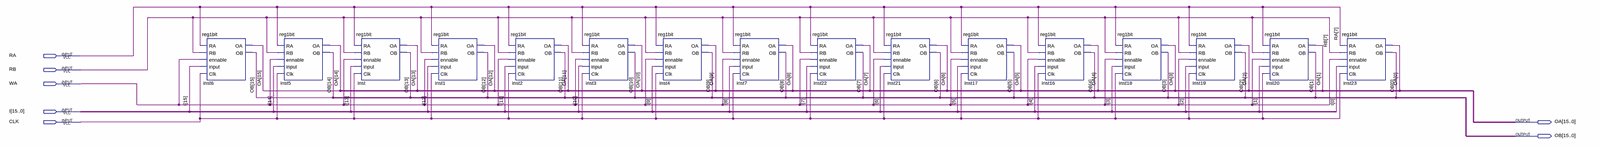
[diagram p0: schematic sheet, whole]
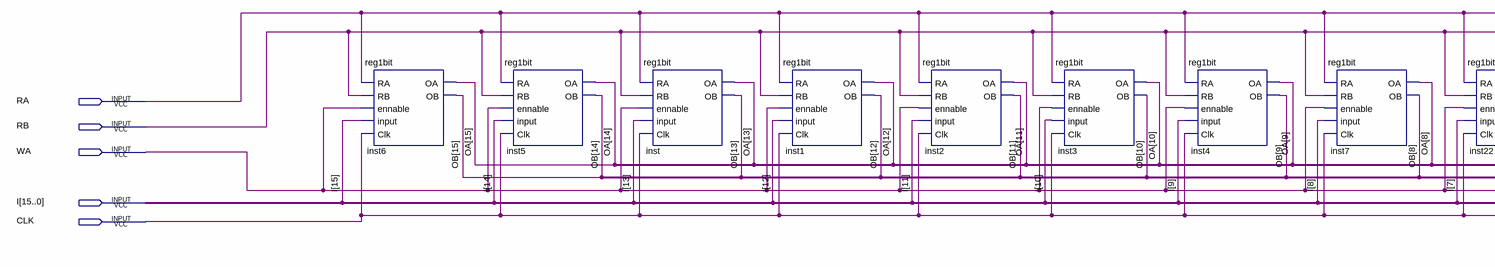
[diagram p1: schematic sheet, left part]
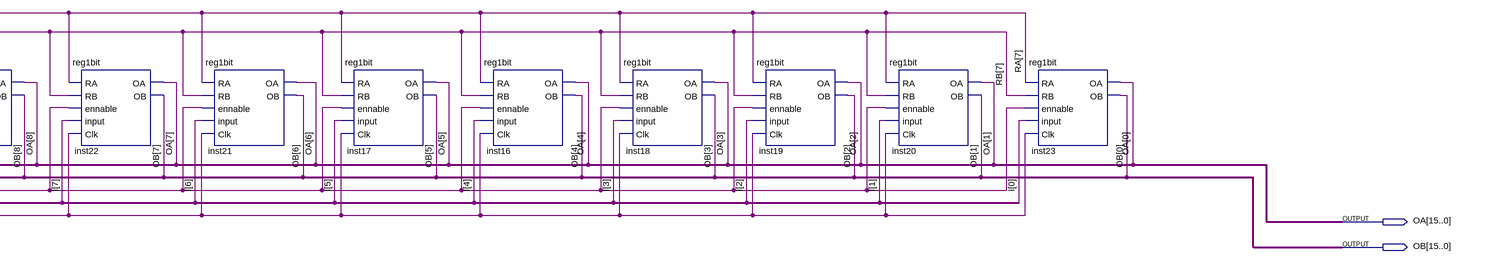
[diagram p2: schematic sheet, right part]
// Quartus schematic reg16bit.bdf as structural Verilog: 16 symbols, 7 pins
module reg16bit (
  input  RA,
  input  RB,
  input  WA,
  input  [15:0] I,
  input  CLK,
  output [15:0] OA,
  output [15:0] OB
);

  reg1bit inst6 (.RA(RA), .RB(RB), .ennable(WA), .\input (I[15]), .Clk(CLK), .OA(OA[15]), .OB(OB[15]));
  reg1bit inst5 (.RA(RA), .RB(RB), .ennable(WA), .\input (I[14]), .Clk(CLK), .OA(OA[14]), .OB(OB[14]));
  reg1bit inst (.RA(RA), .RB(RB), .ennable(WA), .\input (I[13]), .Clk(CLK), .OA(OA[13]), .OB(OB[13]));
  reg1bit inst1 (.RA(RA), .RB(RB), .ennable(WA), .\input (I[12]), .Clk(CLK), .OA(OA[12]), .OB(OB[12]));
  reg1bit inst2 (.RA(RA), .RB(RB), .ennable(WA), .\input (I[11]), .Clk(CLK), .OA(OA[11]), .OB(OB[11]));
  reg1bit inst3 (.RA(RA), .RB(RB), .ennable(WA), .\input (I[10]), .Clk(CLK), .OA(OA[10]), .OB(OB[10]));
  reg1bit inst4 (.RA(RA), .RB(RB), .ennable(WA), .\input (I[9]), .Clk(CLK), .OA(OA[9]), .OB(OB[9]));
  reg1bit inst7 (.RA(RA), .RB(RB), .ennable(WA), .\input (I[8]), .Clk(CLK), .OA(OA[8]), .OB(OB[8]));
  reg1bit inst22 (.RA(RA), .RB(RB), .ennable(WA), .\input (I[7]), .Clk(CLK), .OA(OA[7]), .OB(OB[7]));
  reg1bit inst21 (.RA(RA), .RB(RB), .ennable(WA), .\input (I[6]), .Clk(CLK), .OA(OA[6]), .OB(OB[6]));
  reg1bit inst17 (.RA(RA), .RB(RB), .ennable(WA), .\input (I[5]), .Clk(CLK), .OA(OA[5]), .OB(OB[5]));
  reg1bit inst16 (.RA(RA), .RB(RB), .ennable(WA), .\input (I[4]), .Clk(CLK), .OA(OA[4]), .OB(OB[4]));
  reg1bit inst18 (.RA(RA), .RB(RB), .ennable(WA), .\input (I[3]), .Clk(CLK), .OA(OA[3]), .OB(OB[3]));
  reg1bit inst19 (.RA(RA), .RB(RB), .ennable(WA), .\input (I[2]), .Clk(CLK), .OA(OA[2]), .OB(OB[2]));
  reg1bit inst20 (.RA(RA), .RB(RB), .ennable(WA), .\input (I[1]), .Clk(CLK), .OA(OA[1]), .OB(OB[1]));
  reg1bit inst23 (.RA(RA), .RB(RB), .ennable(WA), .\input (I[0]), .Clk(CLK), .OA(OA[0]), .OB(OB[0]));

  // Other names for the same wires on the sheet: RA[7] = RA; RB[7] = RB
endmodule
